# Altium schematic sheet MotorEncoders.SchDoc
size A; SheetNumber: 2; SheetTotal: 10
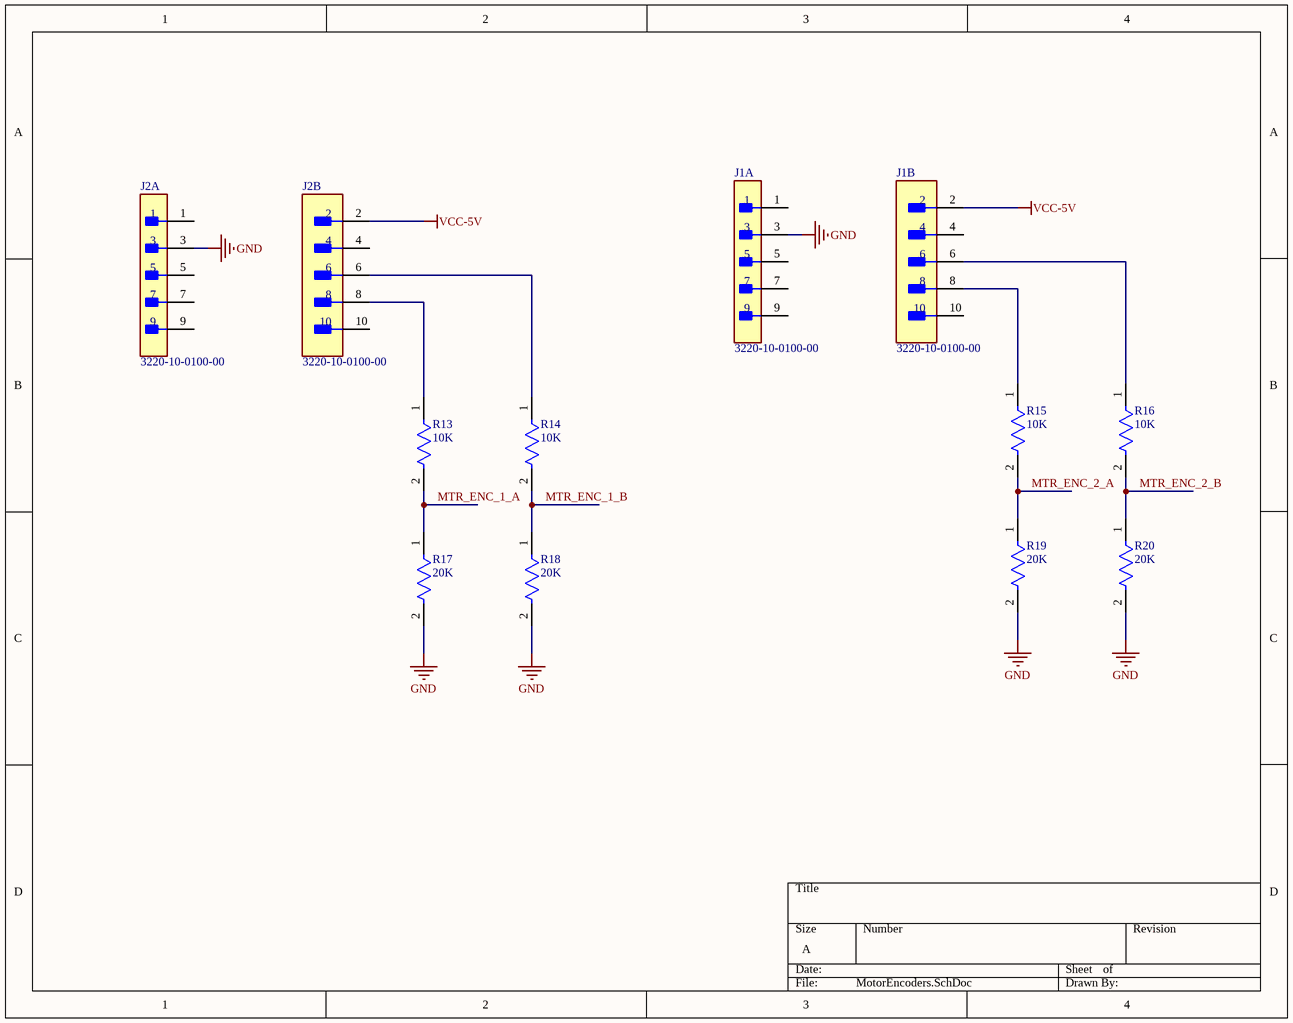
[diagram p0: MotorEncoders.SchDoc]

## Parts
J1  3220-10-0100-00  [FP-3220-10-0100-00-MFG]  (parts A,B of 2)
J2  3220-10-0100-00  [FP-3220-10-0100-00-MFG]  (parts A,B of 2)
R13  10K  [FP-RC0603-0_55-IPC_C]
R14  10K  [FP-RC0603-0_55-IPC_C]
R15  10K  [FP-RC0603-0_55-IPC_C]
R16  10K  [FP-RC0603-0_55-IPC_C]
R17  20K  [FP-RC0603-0_55-IPC_C]
R18  20K  [FP-RC0603-0_55-IPC_C]
R19  20K  [FP-RC0603-0_55-IPC_C]
R20  20K  [FP-RC0603-0_55-IPC_C]

## Nets
GND: J1.3 J2.3 R17.2 R18.2 R19.2 R20.2
VCC-5V: J1.2 J2.2
MTR_ENC_1_A: R13.2 R17.1
MTR_ENC_1_B: R14.2 R18.1
MTR_ENC_2_A: R15.2 R19.1
MTR_ENC_2_B: R16.2 R20.1
NetJ1_6: J1.6 R16.1
NetJ1_8: J1.8 R15.1
NetJ2_6: J2.6 R14.1
NetJ2_8: J2.8 R13.1

Not connected (* = marked no-connect by the designer): J1 1 4 5 7 9 10; J2 1 4 5 7 9 10

## Library data of the parts
J1 J2 = CMP-04151-26714221-1: 3220-10-0100-00 Conn Shrouded Header (4 Sides) HDR 10 POS 1.27mm Solder ST Top Entry Thru-Hole; Current Rating: 1A; Number of Contacts: 10; Connector Type: Male Pin; Contact Plating: Gold; Max Operating Temperature: 105°C; Contact Material: Gold; Number of Positions: 10; Pitch: 1.27mm; Number of Rows: 2; RoHS: Compliant; Row Spacing: 1.27mm; Min Operating Temperature: -40°C; Termination: Solder; NexarPartId: 26714221; Height: 5.6mm; Mount: Through Hole
R13-R16 = CMP-2100-03664-2: RES 10K OHM 1% 1/10W 0603; Voltage Rating: 75V; Voltage Rating (DC): 50V; Resistance: 10kR; Power Rating: 100mW; Temperature Coefficient: 100ppm/°C; Depth: 0.8mm; Termination: SMD/SMT; Resistor Type: Thick Film; Series: RC; Construction: Rectangular; Features: Moisture Resistant; Packaging: Tape and Reel; Min Operating Temperature: -55°C; Number of Terminations: 2; Lead Pitch: 0.3mm; RoHS Compliant: Yes; Case/Package: 0603; Resistance Tolerance: 1%; Military Standard: Not; Weight: 7.1E-05oz; Number of Pins: 2; Tolerance: 1%; Length: 1.6mm; Case Code (Imperial): 0603; Lead Free: Lead Free; Width: 0.8mm; Max Power Dissipation: 100mW; Height: 0.45mm; Max Operating Temperature: 155°C; Case Code (Metric): 1608; Size Code: 0603
R17-R20 = CMP-2000-06932-2: RES 20K OHM 1% 1/10W 0603; Voltage Rating: 50V; Temperature Coefficient: 100ppm/°C; Power Rating: 100mW; Resistance: 20kR; Height: 0.022inch; REACH SVHC: No SVHC; Case Code (Metric): 1608; Depth: 0.8mm; Tolerance: 1%; Min Operating Temperature: -55°C; Series: RC; RoHS Compliant: Yes; Resistor Type: Thick Film; Max Power Dissipation: 100mW; Features: Moisture Resistant; Max Operating Temperature: 155°C; Package Quantity: 1; Size Code: 0603; Packaging: Tape and Reel; Width: 0.031inch; Length: 0.063inch; Military Standard: Not; Technology: THICK FILM; Number of Terminations: 2; Termination: SMD/SMT; Construction: Rectangular; Case/Package: 0603; Number of Pins: 2; Lead Free: Lead Free; Voltage Rating (DC): 50V; Resistance Tolerance: 1%; Case Code (Imperial): 0603